# Altium schematic sheet Total.SCHDOC
size A4 portrait; CompanyName: FairWaves LLC; DrawnBy: Andrey Sviyazov; DocumentNumber: 1; Revision: 1; SheetNumber: 1; SheetTotal: 5; PageSetup: Record=PageOptionsZCenterHorizontal=TrueZCenterVertical=TrueZPrintScale=0.71ZXCorrection=1.00ZYCorrection=1.00ZPrintKind=2ZBorderSize=5000000ZLeftOffset=0ZBottomOffset=0ZOrientation=1ZPaperLength=1000ZPaperWidth=1000ZScale=100ZPaperSource=7ZPrintQuality=-4ZMediaType=1ZDitherType=10ZPaperKind=A4ZPrintScaleMode=1
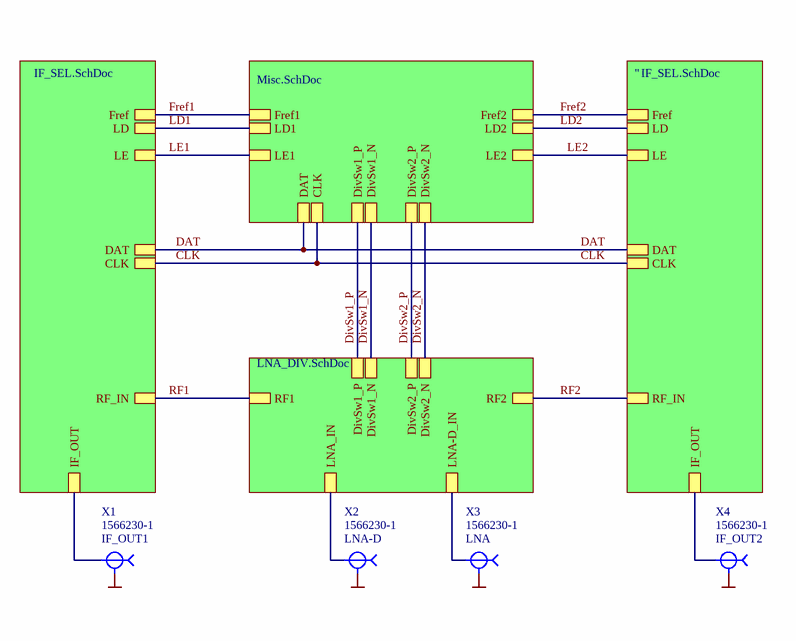
[diagram p0: Total.SCHDOC]

## Parts
X1  1566230-1  Dscription: IF_OUT1  [U_FL]
X2  1566230-1  Dscription: LNA-D  [U_FL]
X3  1566230-1  Dscription: LNA  [U_FL]
X4  1566230-1  Dscription: IF_OUT2  [U_FL]

## Sub-sheets
" = IF_SEL.SchDoc: DAT, CLK, LE, Fref, LD, RF_IN, IF_OUT
? = Misc.SchDoc: DAT, CLK, LE1, Fref1, LD1, DivSw1_P, DivSw1_N, DivSw2_N, DivSw2_P, LE2, Fref2, LD2
? = IF_SEL.SchDoc: DAT, CLK, LE, Fref, LD, RF_IN, IF_OUT
? = LNA_DIV.SchDoc: DivSw2_P, DivSw1_N, DivSw1_P, RF1, RF2, DivSw2_N, LNA_IN, LNA-D_IN

## Nets
GND: X1.2(GND) X2.2(GND) X3.2(GND) X4.2(GND)
CLK: sheet /CLK, sheet "/CLK, sheet /CLK
DAT: sheet /DAT, sheet "/DAT, sheet /DAT
DivSw1_N: sheet /DivSw1_N, sheet /DivSw1_N
DivSw1_P: sheet /DivSw1_P, sheet /DivSw1_P
DivSw2_N: sheet /DivSw2_N, sheet /DivSw2_N
DivSw2_P: sheet /DivSw2_P, sheet /DivSw2_P
Fref1: sheet /Fref1, sheet /Fref
Fref2: sheet /Fref2, sheet "/Fref
LD1: sheet /LD1, sheet /LD
LD2: sheet /LD2, sheet "/LD
LE1: sheet /LE1, sheet /LE
LE2: sheet /LE2, sheet "/LE
RF1: sheet /RF_IN, sheet /RF1
RF2: sheet "/RF_IN, sheet /RF2
NetX1_1: X1.1 ; sheet /IF_OUT
NetX2_1: X2.1 ; sheet /LNA_IN
NetX3_1: X3.1 ; sheet /LNA-D_IN
NetX4_1: X4.1 ; sheet "/IF_OUT

## Library data of the parts
X1-X4 = U_FL: Connector (UMCC); Manufacturer: Tyco Electronics Corp; Name: 1566230-1